# Altium schematic sheet khoi_he_thong.SchDoc
size A4; SheetNumber: 3; SheetTotal: 3
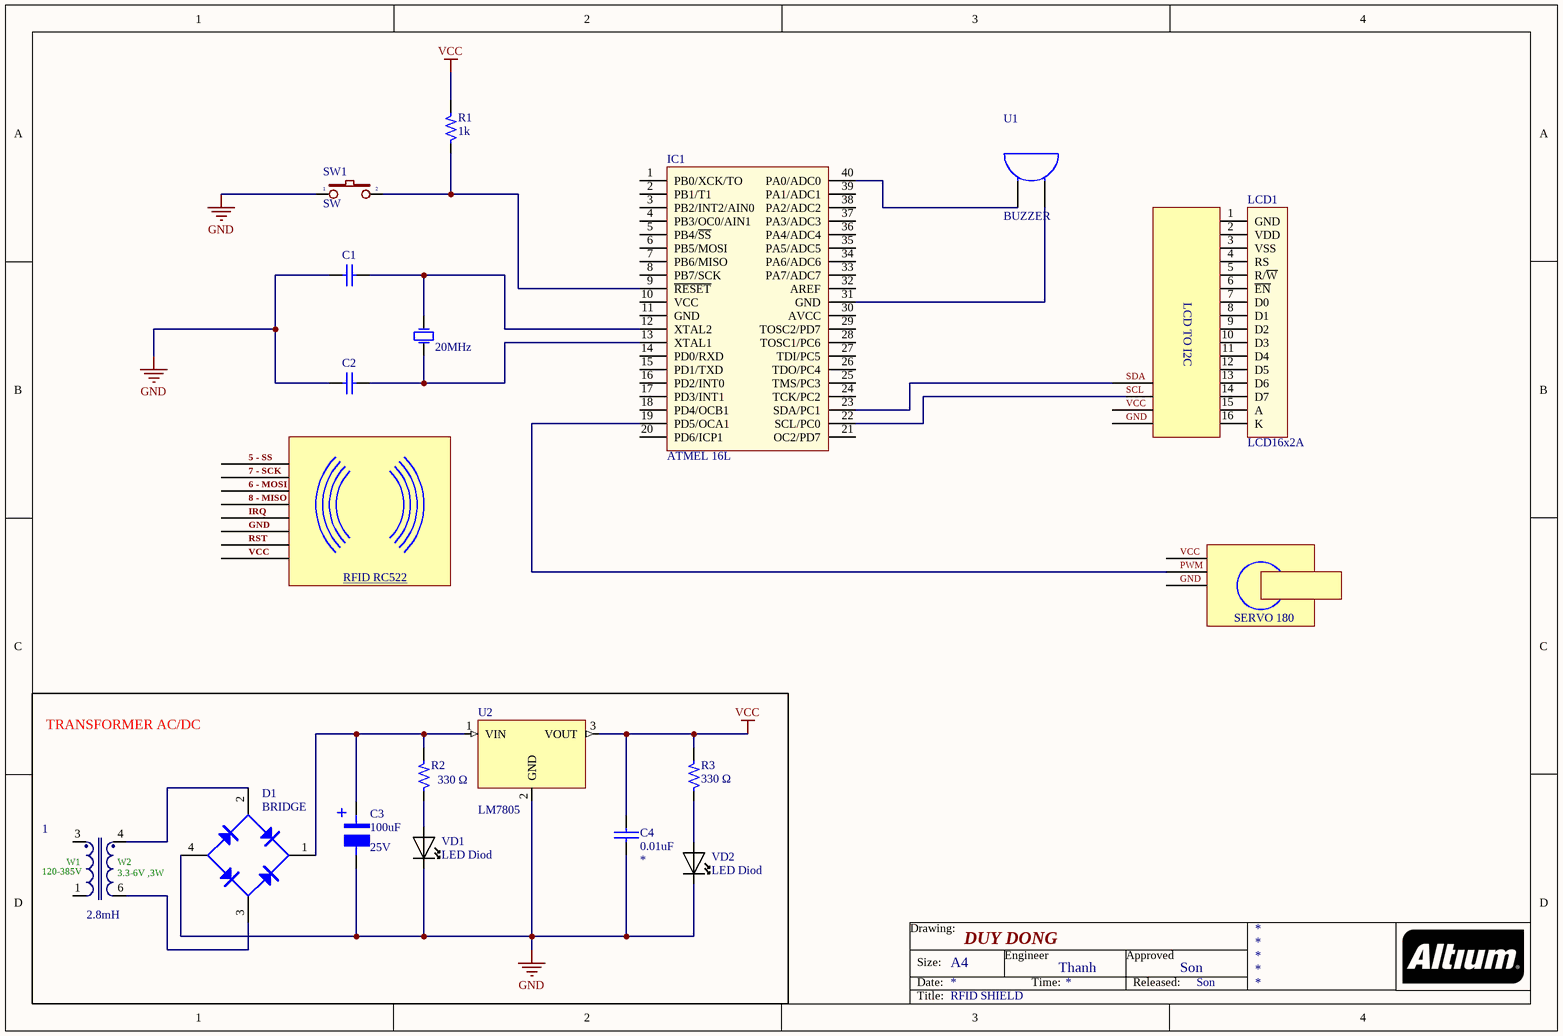
[diagram p0: khoi_he_thong.SchDoc]

## Parts
1  2.8mH  [EE13/7/4-Vertical/(EF12.6)]
C1  (no value)  [103/2KV]
C2  (no value)  [103/2KV]
C3  100uF  [Cap100uFx50V]
C4  0.01uF  [R1206]
D1  BRIDGE  [BRIDGE_DAN]
IC1  ATMEL 16L  [DIP40/W0.6]
LCD1  LCD16x2A  [LCD16X2]
R1  1k  [R1/6W]
R2  330 Ω  [R1/6W]
R3  330 Ω  [R1/6W]
SW1  SW  [SW2]
U1  BUZZER
U2  LM7805  [TO-220]
VD1  LED Diod
VD2  LED Diod
Y1  20MHz  [XT2]

## Blocks framed on the sheet
TRANSFORMER AC/DC: 1 C3 C4 D1 R2 R3 U2 VD1 VD2

## Nets
GND: C1.1 C2.1 C3.2 C4.2 D1.4(V-) SW1.1 U2.2(GND) VD1.K VD2.K
VCC: C4.1 R1.2 R3.2 U2.3(VOUT)
SCL: IC1.22(SCL/PC0)
Net1_4: 1.4 D1.2(AC)
Net1_6: 1.6 D1.3(AC)
NetC1_2: C1.2 IC1.12(XTAL2) Y1.2(OSC2)
NetC2_2: C2.2 IC1.13(XTAL1) Y1.1(OSC1)
NetC3_1: C3.1 D1.1(V+) R2.2 U2.1(VIN)
NetIC1_9: IC1.9(~{RESET}) R1.1 SW1.2
NetIC1_31: IC1.31(GND) U1.2(B)
NetIC1_40: IC1.40(PA0/ADC0) U1.1(A)
NetR2_1: R2.1 VD1.A
NetR3_1: R3.1 VD2.A

Not connected (* = marked no-connect by the designer): 1 1 3; IC1 1(PB0/XCK/TO) 2(PB1/T1) 3(PB2/INT2/AIN0) 4(PB3/OC0/AIN1) 5(PB4/~{SS}) 6(PB5/MOSI) 7(PB6/MISO) 8(PB7/SCK) 10(VCC) 11(GND) 14(PD0/RXD) 15(PD1/TXD) 16(PD2/INT0) 17(PD3/INT1) 18(PD4/OCB1) 19(PD5/OCA1) 20(PD6/ICP1) 21(OC2/PD7) 23(SDA/PC1) 24(TCK/PC2) 25(TMS/PC3) 26(TDO/PC4) 27(TDI/PC5) 28(TOSC1/PC6) 29(TOSC2/PD7) 30(AVCC) 32(AREF) 33(PA7/ADC7) 34(PA6/ADC6) 35(PA5/ADC5) 36(PA4/ADC4) 37(PA3/ADC3) 38(PA2/ADC2) 39(PA1/ADC1); LCD1 1(GND) 2(VDD) 3(VSS) 4(RS) 5(R/~{W}) 6(~{EN}) 7(D0) 8(D1) 9(D2) 10(D3) 11(D4) 12(D5) 13(D6) 14(D7) 15(A) 16(K)

## Notes on the sheet
- LCD TO I2C
- RFID RC522
- SERVO 180
- (near C3) 25V
- Labels drawn without touching a wire or pin: 5 - SS, 6 - MOSI, 7 - SCK, 8 - MISO, GND, IRQ, PWM, RST, SDA, VCC
- Drawing:
- Size:
- Date:
- A4
- DUY DONG
- Engineer
- Time:
- Thanh
- Approved
- Released:
- Son
- Title:
- RFID SHIELD
- (in symbol Cap100uF 50V) +
- (in symbol Tranf5) W1; W2; 120-385V; 3.3-6V ,3W

## Library data of the parts
1 = Tranf5: Off-Line Transformer WE-UNIT , L=2.8mH; PartNo: 749118105; Manufacturer: Würth Elektronik eiSos GmbH; Turns Ratio: 18.9:1; Input Votage (AC): 85-265; Output voltage (DC): 5; Output Current (A): 0.6; Inductance: 2.8mH; ComponentLink1Description: Manufacturer; ComponentLink1URL: http://www.we-online.de; Created by: Otto Christin; Created Date: OCT 2013; ComponentLink2Description: Datasheet; ComponentLink2URL: http://www.we-online.de/katalog/media/pdf/749118105.pdf
C1 C2 = Cap2KV: Capacitor Ceramic 2KV; Published: 8-Jun-2000; LatestRevisionDate: 17-Jul-2002; LatestRevisionNote: Re-released for DXP Platform.; PackageReference: RAD-0.3; Publisher: Altium Limited
C3 = Cap100uF 50V: 220uF: 220uF
C4 = CAP: Capacitor; Footprint: *
D1 = BRIDGE1: Diode Bridge
IC1 = Atmega16L: 8-Bit AVR Microcontroller with 16K Bytes of In-System Programmable Flash Memory; Value: Atmega 16L
LCD1 = LCD16x2: LCD dipslay 16 char, 2 line; Value: LCD16x2A
R1-R3 = Res: Resistor 1/4W; Value: R1/4W - 1K
SW1 = SW2: Switch button 2 pin; Value: SW chip 2 pin
U2 = LM7805: TO-220; Text Field1: 70; Text Field2: 30
Y1 = Crystal: Crystal Oscillator; Published: 8-Jun-2000; LatestRevisionDate: 17-Jul-2002; LatestRevisionNote: Re-released for DXP Platform.; PackageReference: R38; Publisher: Altium Limited